# Altium project CPLD_Breakout.PrjPcb
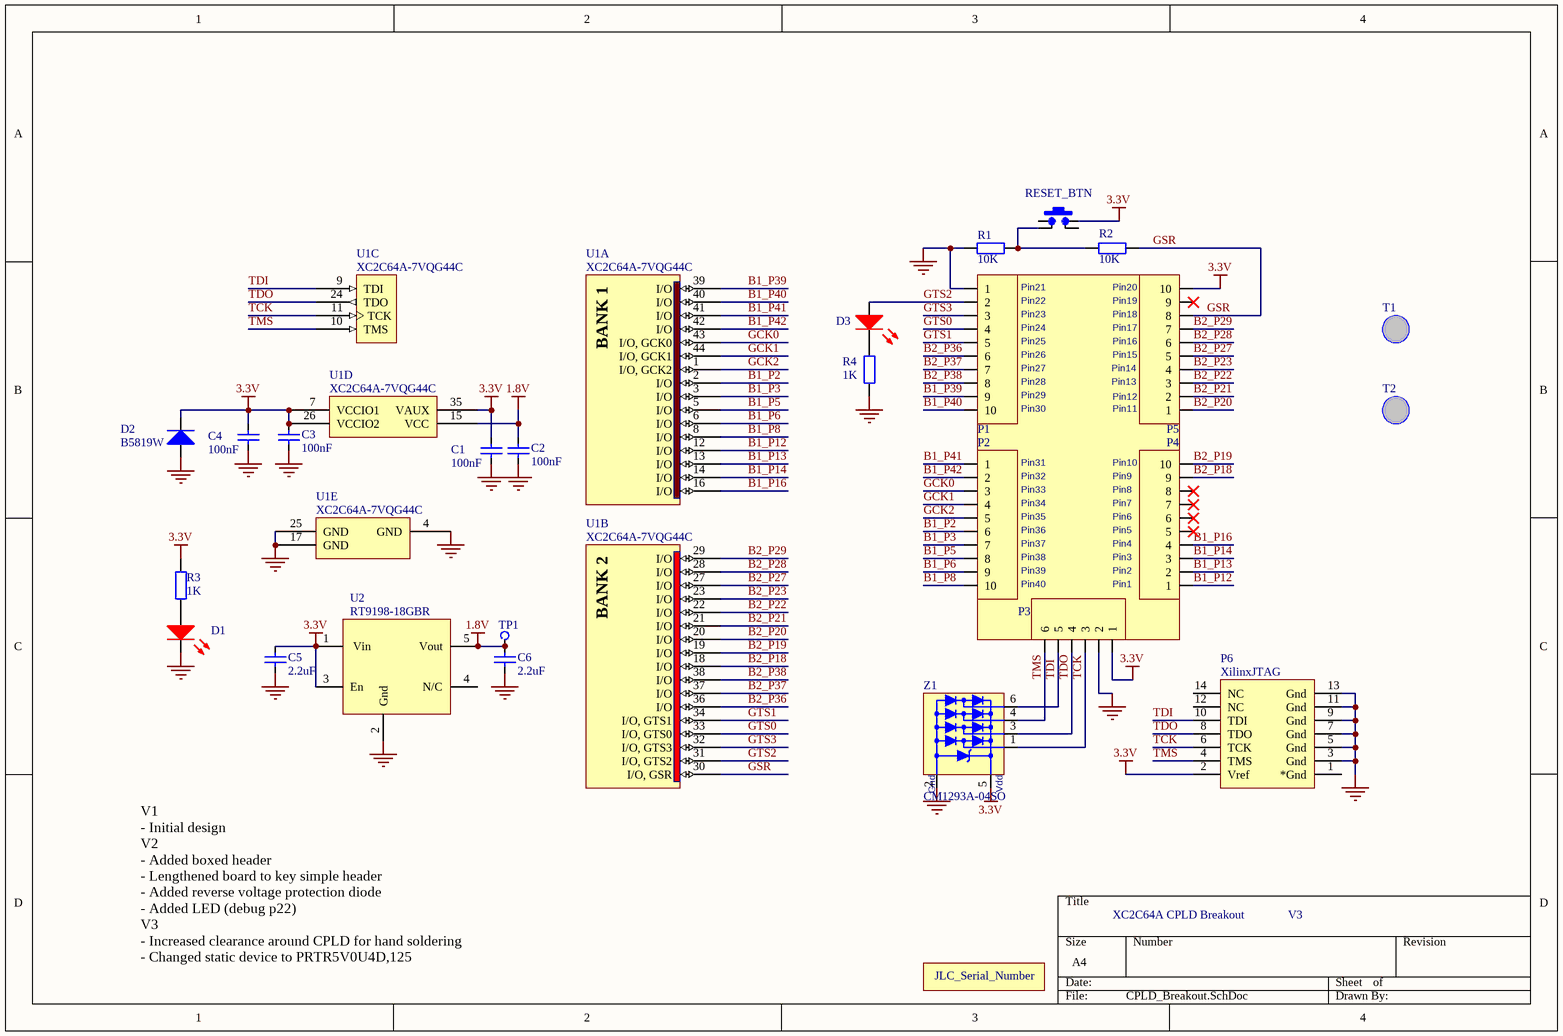
[diagram p0: CPLD_Breakout.SchDoc]
ProjectDescription: XC2C64A CPLD Breakout; ProjectRevision: V3
1 sheet, 27 parts. Net scope: global (net labels, ports and power ports of the same name join across sheets).
Board files: CPLD_Breakout.PcbDoc, CPLD_Breakout_Jig.PcbDoc, CPLD_Breakout.Pcb_Straight.PcbDoc

## Sheet CPLD_Breakout.SchDoc
size A4

### Parts
C1  100nF  [CCNP1608-0603]
C2  100nF  [CCNP1608-0603]
C3  100nF  [CCNP1608-0603]
C4  100nF  [CCNP1608-0603]
C5  2.2uF  [CCNP1608-0603]
C6  2.2uF  [CCNP1608-0603]
D1  LED Red  [LED1608-0603-RED]  (value not drawn)
D2  B5819W  [SOD-123]
D3  LED Red  [LED1608-0603-RED]  (value not drawn)
JLC_Serial_Number  JLC_Serial_Number  [JLC_Serial_Number]  (value not drawn)  (no BOM)
P1  Header, 10-Pin  [HDR1X10S]  (value not drawn)
P2  Header, 10-Pin  [HDR1X10S]  (value not drawn)
P3  Header, 6-Pin  [HDR1X6S]  (value not drawn)
P4  Header, 10-Pin  [HDR1X10S]  (value not drawn)
P5  Header, 10-Pin  [HDR1X10S]  (value not drawn)
P6  XilinxJTAG  [HEADER_2x7_2mm]
R1  10K  [CR1608-0603]
R2  10K  [CR1608-0603]
R3  1K  [CR1608-0603]
R4  1K  [CR1608-0603]
RESET_BTN  SMD-SW-4_5.1x5.1x2.0_M  [SMD-SW-4_5.1x5.1x2.0_M]  (value not drawn)
T1  Tooling Hole  [JLCPCB_Tooling_Hole]  (value not drawn)  (no BOM)
T2  Tooling Hole  [JLCPCB_Tooling_Hole]  (value not drawn)  (no BOM)
TP1  1.8V  [PCBPIN - 0.7mm]  (value not drawn)  (no BOM)
U1  XC2C64A-7VQG44C  [VQG44_M]  (parts A,B,C,D,E of 5)
U2  RT9198-18GBR  [SOT23-5]
Z1  CM1293A-04SO  [SOT457_N]

### Nets
1.8V: C2.2 C6.2 TP1.1(TP) U1.15(VCC) U2.5(Vout)
3.3V: C1.2 C3.2 C4.2 C5.2 D2.K P3.1 P5.10 P6.2(Vref) R3.2 RESET_BTN.1b U1.7(VCCIO1) U1.26(VCCIO2) U1.35(VAUX) U2.1(Vin) U2.3(En) Z1.5(Vp)
GND: C1.1 C2.1 C3.1 C4.1 C5.1 C6.1 D1.K D2.A P1.1 P3.2 P6.3(Gnd) P6.5(Gnd) P6.7(Gnd) P6.9(Gnd) P6.11(Gnd) P6.13(Gnd) R1.2 R4.1 U1.4(GND) U1.17(GND) U1.25(GND) U2.2(Gnd) Z1.2(Vn)
B1_P2: P2.6 U1.2(I/O)
B1_P3: P2.7 U1.3(I/O)
B1_P5: P2.8 U1.5(I/O)
B1_P6: P2.9 U1.6(I/O)
B1_P8: P2.10 U1.8(I/O)
B1_P12: P4.1 U1.12(I/O)
B1_P13: P4.2 U1.13(I/O)
B1_P14: P4.3 U1.14(I/O)
B1_P16: P4.4 U1.16(I/O)
B1_P39: P1.9 U1.39(I/O)
B1_P40: P1.10 U1.40(I/O)
B1_P41: P2.1 U1.41(I/O)
B1_P42: P2.2 U1.42(I/O)
B2_P18: P4.9 U1.18(I/O)
B2_P19: P4.10 U1.19(I/O)
B2_P20: P5.1 U1.20(I/O)
B2_P21: P5.2 U1.21(I/O)
B2_P22: P5.3 U1.22(I/O)
B2_P23: P5.4 U1.23(I/O)
B2_P27: P5.5 U1.27(I/O)
B2_P28: P5.6 U1.28(I/O)
B2_P29: P5.7 U1.29(I/O)
B2_P36: P1.6 U1.36(I/O)
B2_P37: P1.7 U1.37(I/O)
B2_P38: P1.8 U1.38(I/O)
GCK0: P2.3 U1.43(I/O,_GCK0)
GCK1: P2.4 U1.44(I/O,_GCK1)
GCK2: P2.5 U1.1(I/O,_GCK2)
GSR: P5.8 R2.1 U1.30(I/O,_GSR)
GTS0: P1.4 U1.33(I/O,_GTS0)
GTS1: P1.5 U1.34(I/O,_GTS1)
GTS2: D3.A P1.2 U1.31(I/O,_GTS2)
GTS3: P1.3 U1.32(I/O,_GTS3)
TCK: P3.3 P6.6(TCK) U1.11(TCK) Z1.1
TDI: P3.5 P6.10(TDI) U1.9(TDI) Z1.6
TDO: P3.4 P6.8(TDO) U1.24(TDO) Z1.3
TMS: P3.6 P6.4(TMS) U1.10(TMS) Z1.4
NetD1_A: D1.A R3.1
NetD3_K: D3.K R4.2
NetR1_1: R1.1 R2.2 RESET_BTN.2

Not connected (* = marked no-connect by the designer): P4 5* 6* 7* 8*; P5 9*; P6 1(*Gnd) 12(NC) 14(NC); RESET_BTN 1 2b; U2 4(N/C)

### Notes on the sheet
- Pin21
- Pin22
- Pin23
- Pin18
- Pin19
- Pin20
- (near P1) Pin24
- (near P1) Pin25
- (near P1) Pin26
- (near P1) Pin27
- (near P1) Pin28
- (near P5) Pin13
- (near P5) Pin14
- (near P5) Pin15
- (near P5) Pin16
- (near P5) Pin17
- (near P1) Pin29
- Pin30
- Pin11
- (near P5) Pin12
- Pin31
- (near P2) Pin32
- (near P2) Pin33
- (near P2) Pin34
- (near P2) Pin35
- (near P4) Pin6
- (near P4) Pin7
- (near P4) Pin8
- (near P4) Pin9
- Pin10
- (near P2) Pin36
- (near P2) Pin37
- (near P2) Pin38
- Pin39
- Pin40
- Pin1
- Pin2
- Pin3
- (near P4) Pin4
- (near P4) Pin5
- (near U1) V1
  - Initial design
  V2
  - Added boxed header
  - Lengthened board to key simple header
  - Added reverse voltage protection diode
  - Added LED (debug p22)
  V3
  - Increased clearance around CPLD for hand soldering
  - Changed static device to PRTR5V0U4D,125
- (in symbol CM1293A-04SO) Gnd; Vdd
- (in symbol XC2C64-7VQ44C, part A) BANK 1
- (in symbol XC2C64-7VQ44C, part B) BANK 2

### Library data of the parts
C1-C4 = Cap_CCNP_0603: Capacitor non-polar SMT 0603; Manufacturer: Generic Components; Class: Passive; Published: 08/06/2000; Publisher: Altium Hobart Technology Centre; SubClass: Capacitor; Farnell PN: *; Digikey: *; Value: 100nF; LCSC: C14663
C5 C6 = Cap: Capacitor; Manufacturer: Generic Components; Class: Passive; Published: 08/06/2000; Publisher: Altium Hobart Technology Centre; SubClass: Capacitor; Farnell PN: *; Digikey: *; Value: 2.2uF; LCSC: C23630
D1 D3 = LED-0603-Red: LED 0603 Red; Manufacturer: Generic Components; Class I: Optoelectronic; Published: 8-Jun-2000; Revision: July-2002: Re-released for DXP Platform.; Publisher: Altium Limited; Class II: LED; Farnell PN: 1581239; Digikey: *; LCSC: C2286
D2 = B5819W: Schottky diode1A 40V Vrm SOD-123; Manufacturer: Generic Components; Class: Discrete; SubClass: Diode - Switching; Published: 08/06/2000; Publisher: Altium Hobart Technology Centre; Digikey: *; Farnell PN: *; LCSC: C8598
P1 P2 P4 P5 = Header 1x10: LatestRevisionDate: 17-Jul-2002; LatestRevisionNote: Re-released for DXP Platform.; Publisher: Altium Limited; LCSC: *
P3 = Header 1x6: LatestRevisionDate: 17-Jul-2002; LatestRevisionNote: Re-released for DXP Platform.; Publisher: Altium Limited; LCSC: *; Farnell PN: 1835481; Digikey: 609-3272-ND
R1-R4 = Res_CR0603: Resistor SMT 0603; Manufacturer: Generic Components; Class: Passive; Published: 08/06/2000; Publisher: Altium Hobart Technology Centre; SubClass: Resistor; Farnell PN: *; Digikey: *
  R1 R2: Value: 10K; LCSC: C25804
  R3 R4: Value: 1K; LCSC: C21190
RESET_BTN = SW_PB-TS: Tactile Switch SPST 5.10mm X 5.10mm / (1.5mm=C318884) / (2.0mm=C318888) / (3.5mm=C318886); Revision: 1.0; LCSC: C318888
T1 T2 = JLC_Tooling_Hole
TP1 = TP: Test Point; Digikey: *; Farnell PN: *; LCSC: *
U1 = XC2C64-7VQ44C: CoolRunner-II 1.8V, 64 Macrocell CPLD, 33 User I/Os, 44-Pin VQFP, Commercial Grade, Pb-Free; DatasheetVersion: ver2.3, Nov-2008; PackageVersion: ver1.2, Jun-2004; PackageReference: VQG44; PackageDescription: 44-Pin Very Thin Quad Flat Pack (VQG44) - Pb-Free; Code_JEDEC: MS-026-ACB; Digikey: 122-1410-ND; Farnell PN: 2831286; LCSC: *
U2 = RT9198-18GBR: 1.8V 300mA LDO with enable, uses low ESR cap (ceramic); LCSC: C130834; Farnell PN: 2363142; Digikey: RT9198-18GBR-ND
Z1 = CM1293A-04SO: Ultra low capacitance quadruple rail-to-rail ESD protection; Farnell PN: 2533258; Digikey: CM1293A-04SOOSCT-ND; LCSC: C393377
P6 = XilinxJTAG: LCSC: *

## Assembly variants
Simple JTAG header (right-angle): not fitted P6
Simple JTAG header (straight): not fitted P6; alternate parts P3 -> Header 1x6
Boxed JTAG header: not fitted P3